# Altium schematic sheet Matrix of Stuffed parts vs application - Copy.SchDoc
size A
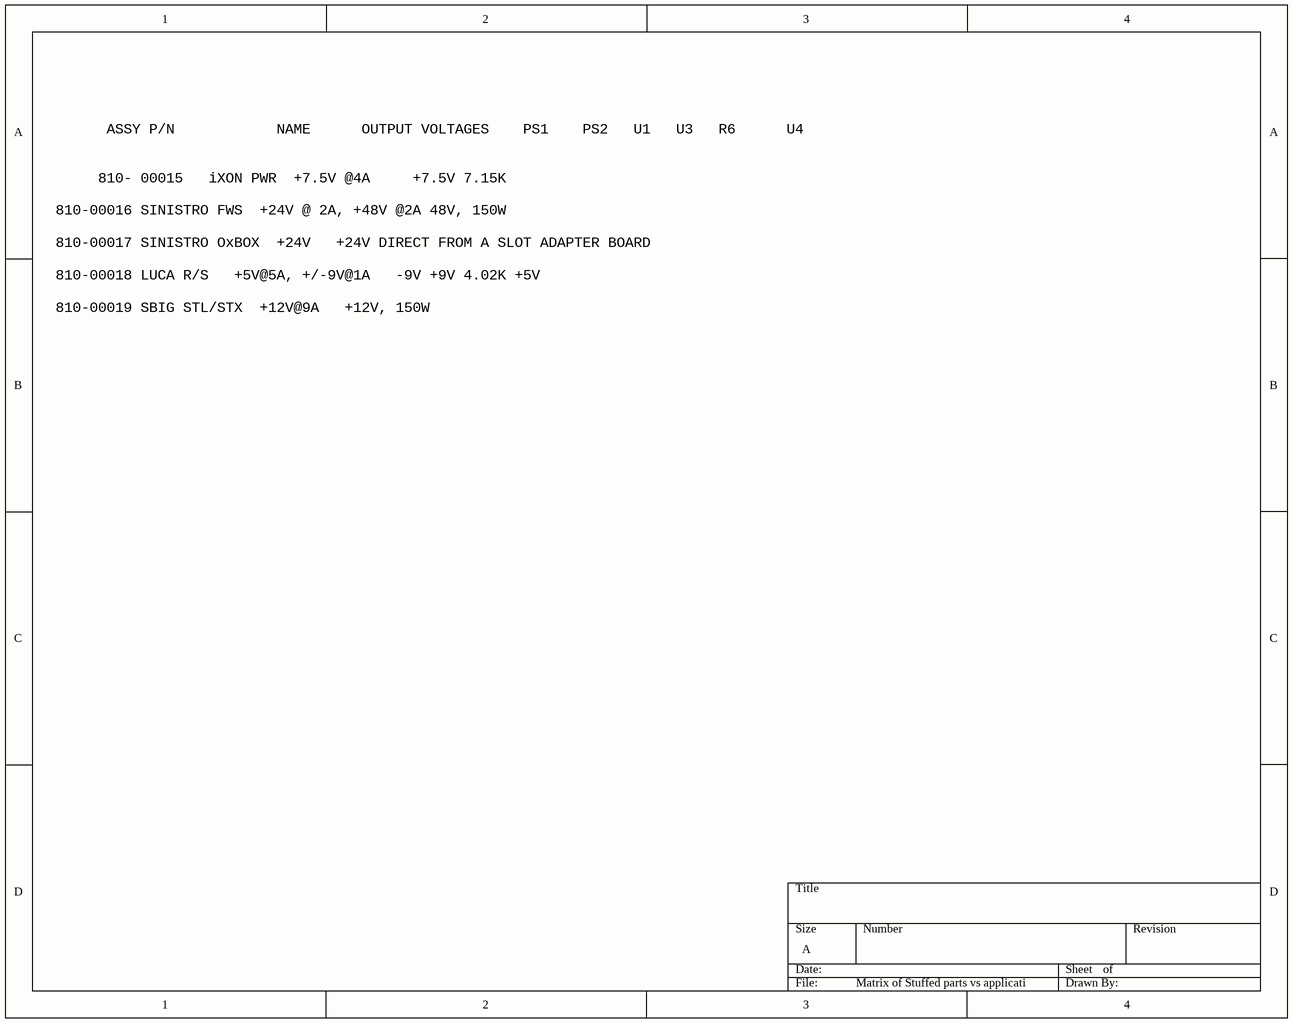
[diagram p0: Matrix of Stuffed parts vs application - Copy.SchDoc]

## Notes on the sheet
- ASSY P/N         	  NAME   			OUTPUT VOLTAGES  	 PS1 	  PS2 		U1  	U3  	R6    	 U4
  810- 00015  	iXON PWR		+7.5V @4A					+7.5V	7.15K
  810-00016	SINISTRO FWS		+24V @ 2A, +48V @2A	48V, 150W
  810-00017	SINISTRO OxBOX		+24V			+24V DIRECT FROM A SLOT ADAPTER BOARD
  810-00018	LUCA R/S			+5V@5A, +/-9V@1A			-9V	+9V	4.02K	+5V
  810-00019	SBIG STL/STX		+12V@9A			+12V, 150W